# Altium schematic sheet Contoller.SchDoc
size A
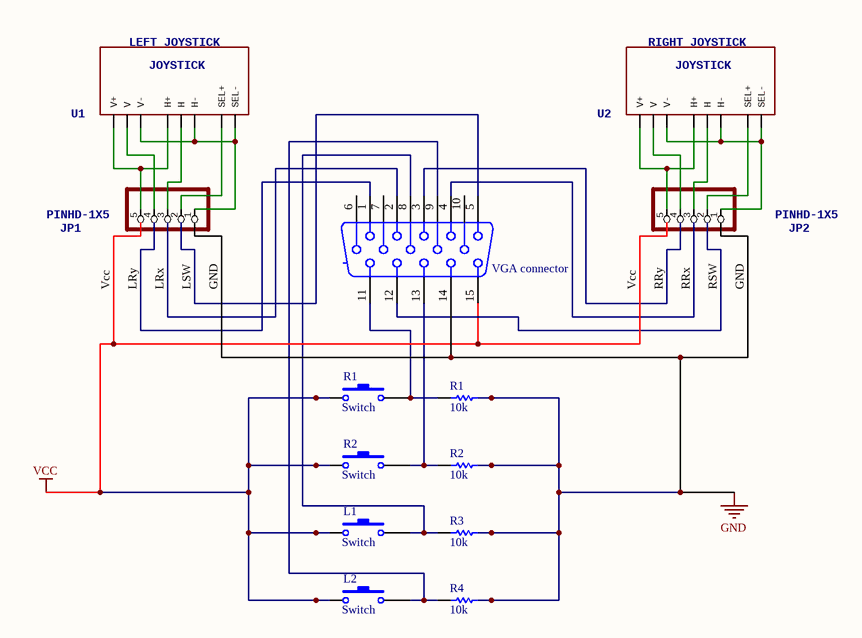
[diagram p0: Contoller.SchDoc]

## Parts
(Parts that share a designator on the sheet are numbered #1, #2 ... from top to bottom, then left to right.)
J?  VGA connector  [050DSUB0.762-4H15]
JP1#1  >NAME: JP1  [1X05]  (hidden comment: PINHD-1X5)
JP1#2  >NAME: JP2  [1X05]  (hidden comment: PINHD-1X5)
L1  Switch  [SPST-2]
L2  Switch  [SPST-2]
R1#1  Switch  [SPST-2]
R1#2  10k  [AXIAL-0.3]
R2#1  Switch  [SPST-2]
R2#2  10k  [AXIAL-0.3]
R3  10k  [AXIAL-0.3]
R4  10k  [AXIAL-0.3]
U1#1  >Name: U1  >Value: LEFT JOYSTICK  [JOYSTICK]  (hidden comment: JOYSTICKPTH)
U1#2  >Name: U2  >Value: RIGHT JOYSTICK  [JOYSTICK]  (hidden comment: JOYSTICKPTH)

## Nets
GND: J?.14 R1#2.2 R2#2.2 R3.2 R4.2
Vcc: J?.15 L1.1 L2.1 R1#1.1 R2#1.1
LRx: J?.2
LRy: J?.1
LSW: J?.5
RRx: J?.4
RRy: J?.3
RSW: J?.12
NetJ?_8: J?.8 L1.2 R3.1
NetJ?_9: J?.9 L2.2 R4.1
NetJ?_11: J?.11 R1#1.2 R1#2.1
NetJ?_13: J?.13 R2#1.2 R2#2.1
NetJP1#1_1: JP1#1.1 U1#1.B2A(SEL-) U1#1.H3(H-) U1#1.V3(V-)
NetJP1#1_2: JP1#1.2 U1#1.B1A(SEL+)
NetJP1#1_3: JP1#1.3 U1#1.H2(H)
NetJP1#1_4: JP1#1.4 U1#1.V2(V)
NetJP1#1_5: JP1#1.5 U1#1.H1(H+) U1#1.V1(V+)
NetJP1#2_1: JP1#2.1 U1#2.B2A(SEL-) U1#2.H3(H-) U1#2.V3(V-)
NetJP1#2_2: JP1#2.2 U1#2.B1A(SEL+)
NetJP1#2_3: JP1#2.3 U1#2.H2(H)
NetJP1#2_4: JP1#2.4 U1#2.V2(V)
NetJP1#2_5: JP1#2.5 U1#2.H1(H+) U1#2.V1(V+)

Not connected (* = marked no-connect by the designer): J? 6 7 10 16(MH1) 17(MH2)

## Library data of the parts
J? = Connector 15: Receptacle Assembly, 15-Pin, Sim Line Connector; PackageDocument: B; Positions: 15; Gender: Receptacle Header; Published: 15-Jun-2001; LatestRevisionDate: 17-Jul-2002; LatestRevisionNote: Re-released for DXP Platform.; DatasheetDocument: 24-Nov-1999; PackageReference: 788574; Publisher: Altium Limited; Orientation: Right Angle
JP1#1 JP1#2 = PINHD-1X5: <b>PIN HEADER</b>; >VALUE: PINHD-1X5
L1 L2 R1#1 R2#1 = SW-PB: Published: 24-Mar-1999; LatestRevisionDate: 17-Jul-2002; LatestRevisionNote: Re-released for DXP Platform.; PackageReference: SPST-2; Publisher: Altium Limited; PackageDescription: Switch
R1#2 R2#2 R3 R4 = Res1: Resistor; Published: 8-Jun-2000; LatestRevisionDate: 17-Jul-2002; LatestRevisionNote: Re-released for DXP Platform.; PackageReference: AXIAL-0.3; Publisher: Altium Limited; PackageDescription: Axial Device, Thru-Hole; 2 Leads; 0.3 in Pin Spacing; Value: 10k
U1#1 U1#2 = JOYSTICKPTH: <b>Thumb Joystick</b> / Joystick commonly found in PS2 controllers. Two pots and a select switch. Adapted from Sparkfun Library (but for more common 6mm switch sticks); JOYSTICK: JOYSTICK